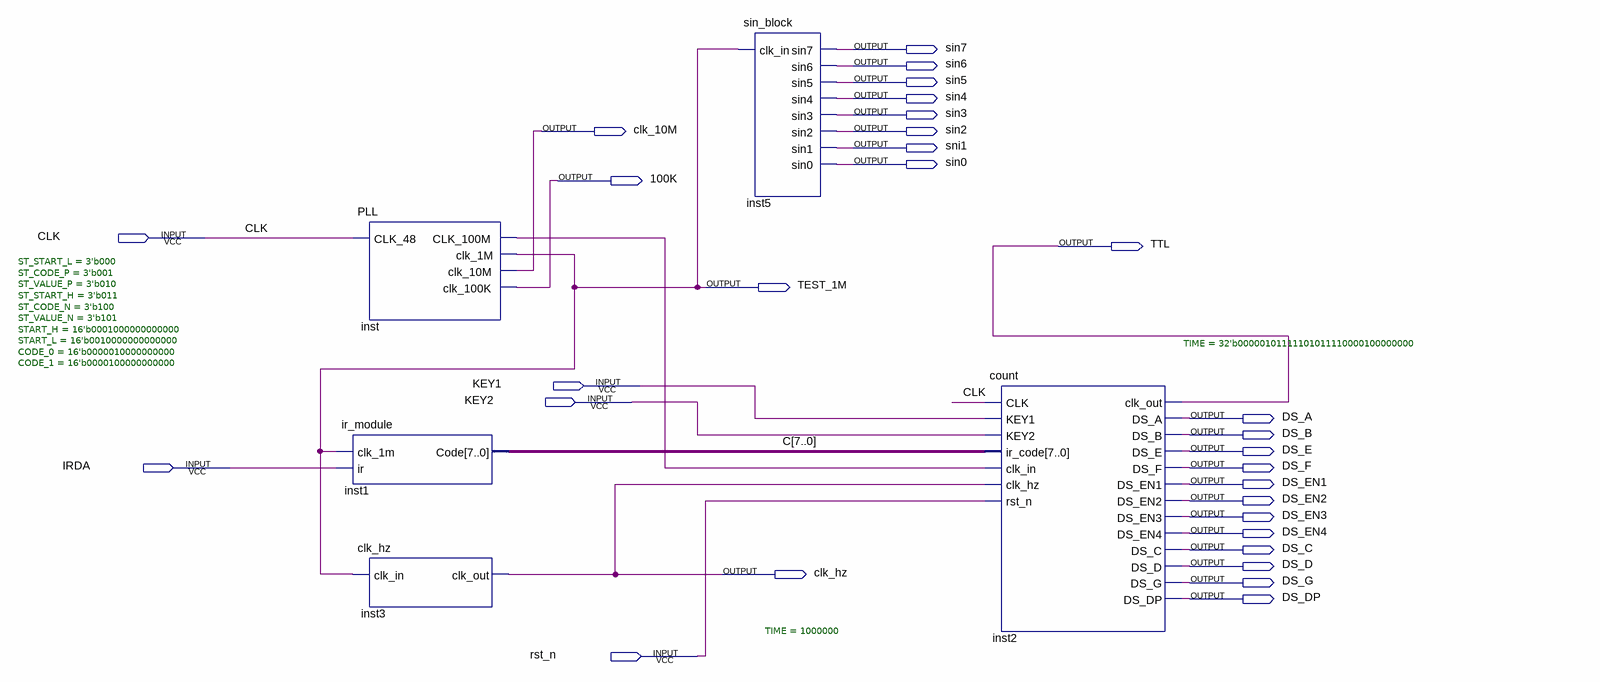
[diagram p0: schematic sheet]
// Quartus schematic signal.bdf as structural Verilog: 5 symbols, 30 pins
module signal (
  input  CLK,
  input  KEY1,
  input  KEY2,
  input  IRDA,
  input  rst_n,
  output sin7,
  output sin6,
  output sin5,
  output sin4,
  output sin3,
  output clk_10M,
  output sin2,
  output sni1,
  output sin0,
  output \100K ,
  output TTL,
  output TEST_1M,
  output DS_A,
  output DS_B,
  output DS_E,
  output DS_F,
  output DS_EN1,
  output DS_EN2,
  output DS_EN3,
  output DS_EN4,
  output DS_C,
  output DS_D,
  output clk_hz,
  output DS_G,
  output DS_DP
);

  wire inst_clk_100m;
  wire [7:0] C;

  PLL inst (.CLK_48(CLK), .CLK_100M(inst_clk_100m), .clk_1M(TEST_1M), .clk_10M(clk_10M), .clk_100K(\100K ));
  ir_module #(.ST_START_L(3'b000), .ST_CODE_P(3'b001), .ST_VALUE_P(3'b010), .ST_START_H(3'b011), .ST_CODE_N(3'b100), .ST_VALUE_N(3'b101), .START_H(16'b0001000000000000), .START_L(16'b0010000000000000), .CODE_0(16'b0000010000000000), .CODE_1(16'b0000100000000000)) inst1 (
    .clk_1m(TEST_1M), .ir(IRDA), .Code(C));
  clk_hz #(.TIME(1000000)) inst3 (.clk_in(TEST_1M), .clk_out(clk_hz));
  sin_block inst5 (
    .clk_in(TEST_1M), .sin7(sin7), .sin6(sin6), .sin5(sin5), .sin4(sin4), .sin3(sin3), .sin2(sin2),
    .sin1(sni1), .sin0(sin0));
  count #(.TIME(32'b00000101111101011110000100000000)) inst2 (
    .CLK(CLK), .KEY1(KEY1), .KEY2(KEY2), .ir_code(C), .clk_in(inst_clk_100m), .clk_hz(clk_hz), .rst_n(rst_n),
    .clk_out(TTL), .DS_A(DS_A), .DS_B(DS_B), .DS_E(DS_E), .DS_F(DS_F), .DS_EN1(DS_EN1), .DS_EN2(DS_EN2),
    .DS_EN3(DS_EN3), .DS_EN4(DS_EN4), .DS_C(DS_C), .DS_D(DS_D), .DS_G(DS_G), .DS_DP(DS_DP));
endmodule
